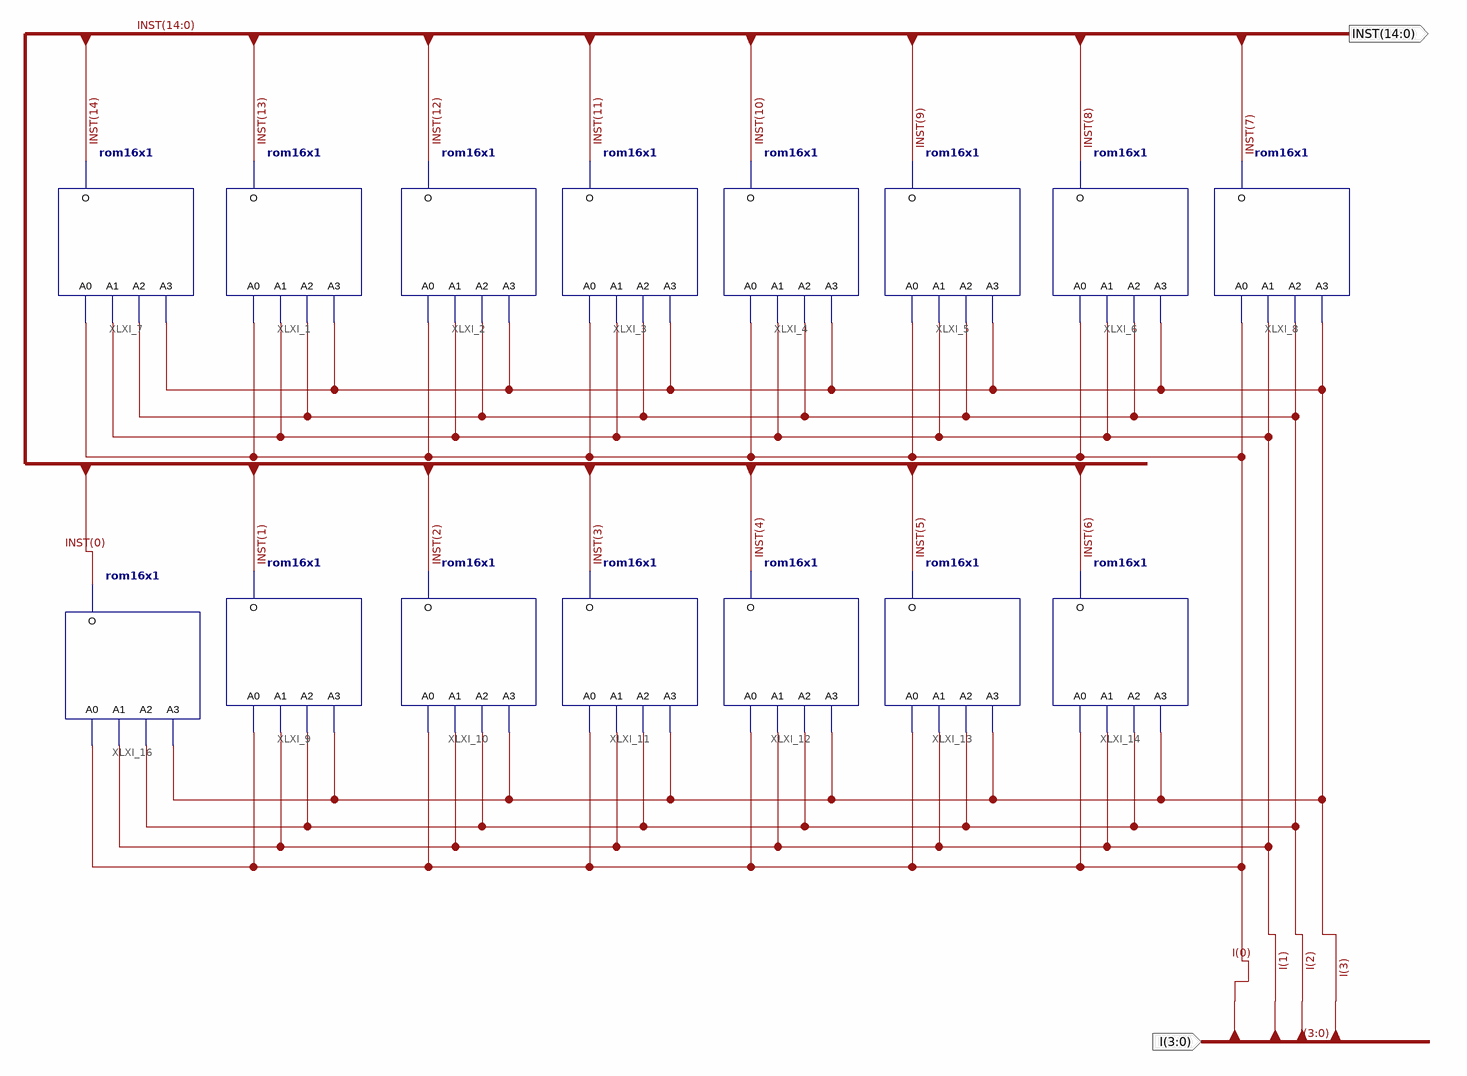
[diagram p0: schematic sheet 1]
// Xilinx ISE schematic PR_2.sch (spartan3e) as structural Verilog: 15 symbols, 2 ports
module PR_2 (
  input  [3:0] I,
  output [14:0] INST
);

  rom16x1 #(.INIT("0067")) XLXI_1 (.A0(I[0]), .A1(I[1]), .A2(I[2]), .A3(I[3]), .O(INST[13]));
  rom16x1 #(.INIT("0070")) XLXI_2 (.A0(I[0]), .A1(I[1]), .A2(I[2]), .A3(I[3]), .O(INST[12]));
  rom16x1 #(.INIT("0019")) XLXI_3 (.A0(I[0]), .A1(I[1]), .A2(I[2]), .A3(I[3]), .O(INST[11]));
  rom16x1 #(.INIT("001B")) XLXI_4 (.A0(I[0]), .A1(I[1]), .A2(I[2]), .A3(I[3]), .O(INST[10]));
  rom16x1 #(.INIT("001D")) XLXI_5 (.A0(I[0]), .A1(I[1]), .A2(I[2]), .A3(I[3]), .O(INST[9]));
  rom16x1 #(.INIT("0000")) XLXI_6 (.A0(I[0]), .A1(I[1]), .A2(I[2]), .A3(I[3]), .O(INST[8]));
  rom16x1 #(.INIT("0058")) XLXI_7 (.A0(I[0]), .A1(I[1]), .A2(I[2]), .A3(I[3]), .O(INST[14]));
  rom16x1 #(.INIT("0010")) XLXI_8 (.A0(I[0]), .A1(I[1]), .A2(I[2]), .A3(I[3]), .O(INST[7]));
  rom16x1 #(.INIT("0031")) XLXI_9 (.A0(I[0]), .A1(I[1]), .A2(I[2]), .A3(I[3]), .O(INST[1]));
  rom16x1 #(.INIT("0012")) XLXI_10 (.A0(I[0]), .A1(I[1]), .A2(I[2]), .A3(I[3]), .O(INST[2]));
  rom16x1 #(.INIT("0001")) XLXI_11 (.A0(I[0]), .A1(I[1]), .A2(I[2]), .A3(I[3]), .O(INST[3]));
  rom16x1 #(.INIT("0000")) XLXI_12 (.A0(I[0]), .A1(I[1]), .A2(I[2]), .A3(I[3]), .O(INST[4]));
  rom16x1 #(.INIT("0000")) XLXI_13 (.A0(I[0]), .A1(I[1]), .A2(I[2]), .A3(I[3]), .O(INST[5]));
  rom16x1 #(.INIT("0008")) XLXI_14 (.A0(I[0]), .A1(I[1]), .A2(I[2]), .A3(I[3]), .O(INST[6]));
  rom16x1 #(.INIT("0024")) XLXI_16 (.A0(I[0]), .A1(I[1]), .A2(I[2]), .A3(I[3]), .O(INST[0]));
endmodule
